# EAGLE design T00R10 (EAGLE 9.6.1)
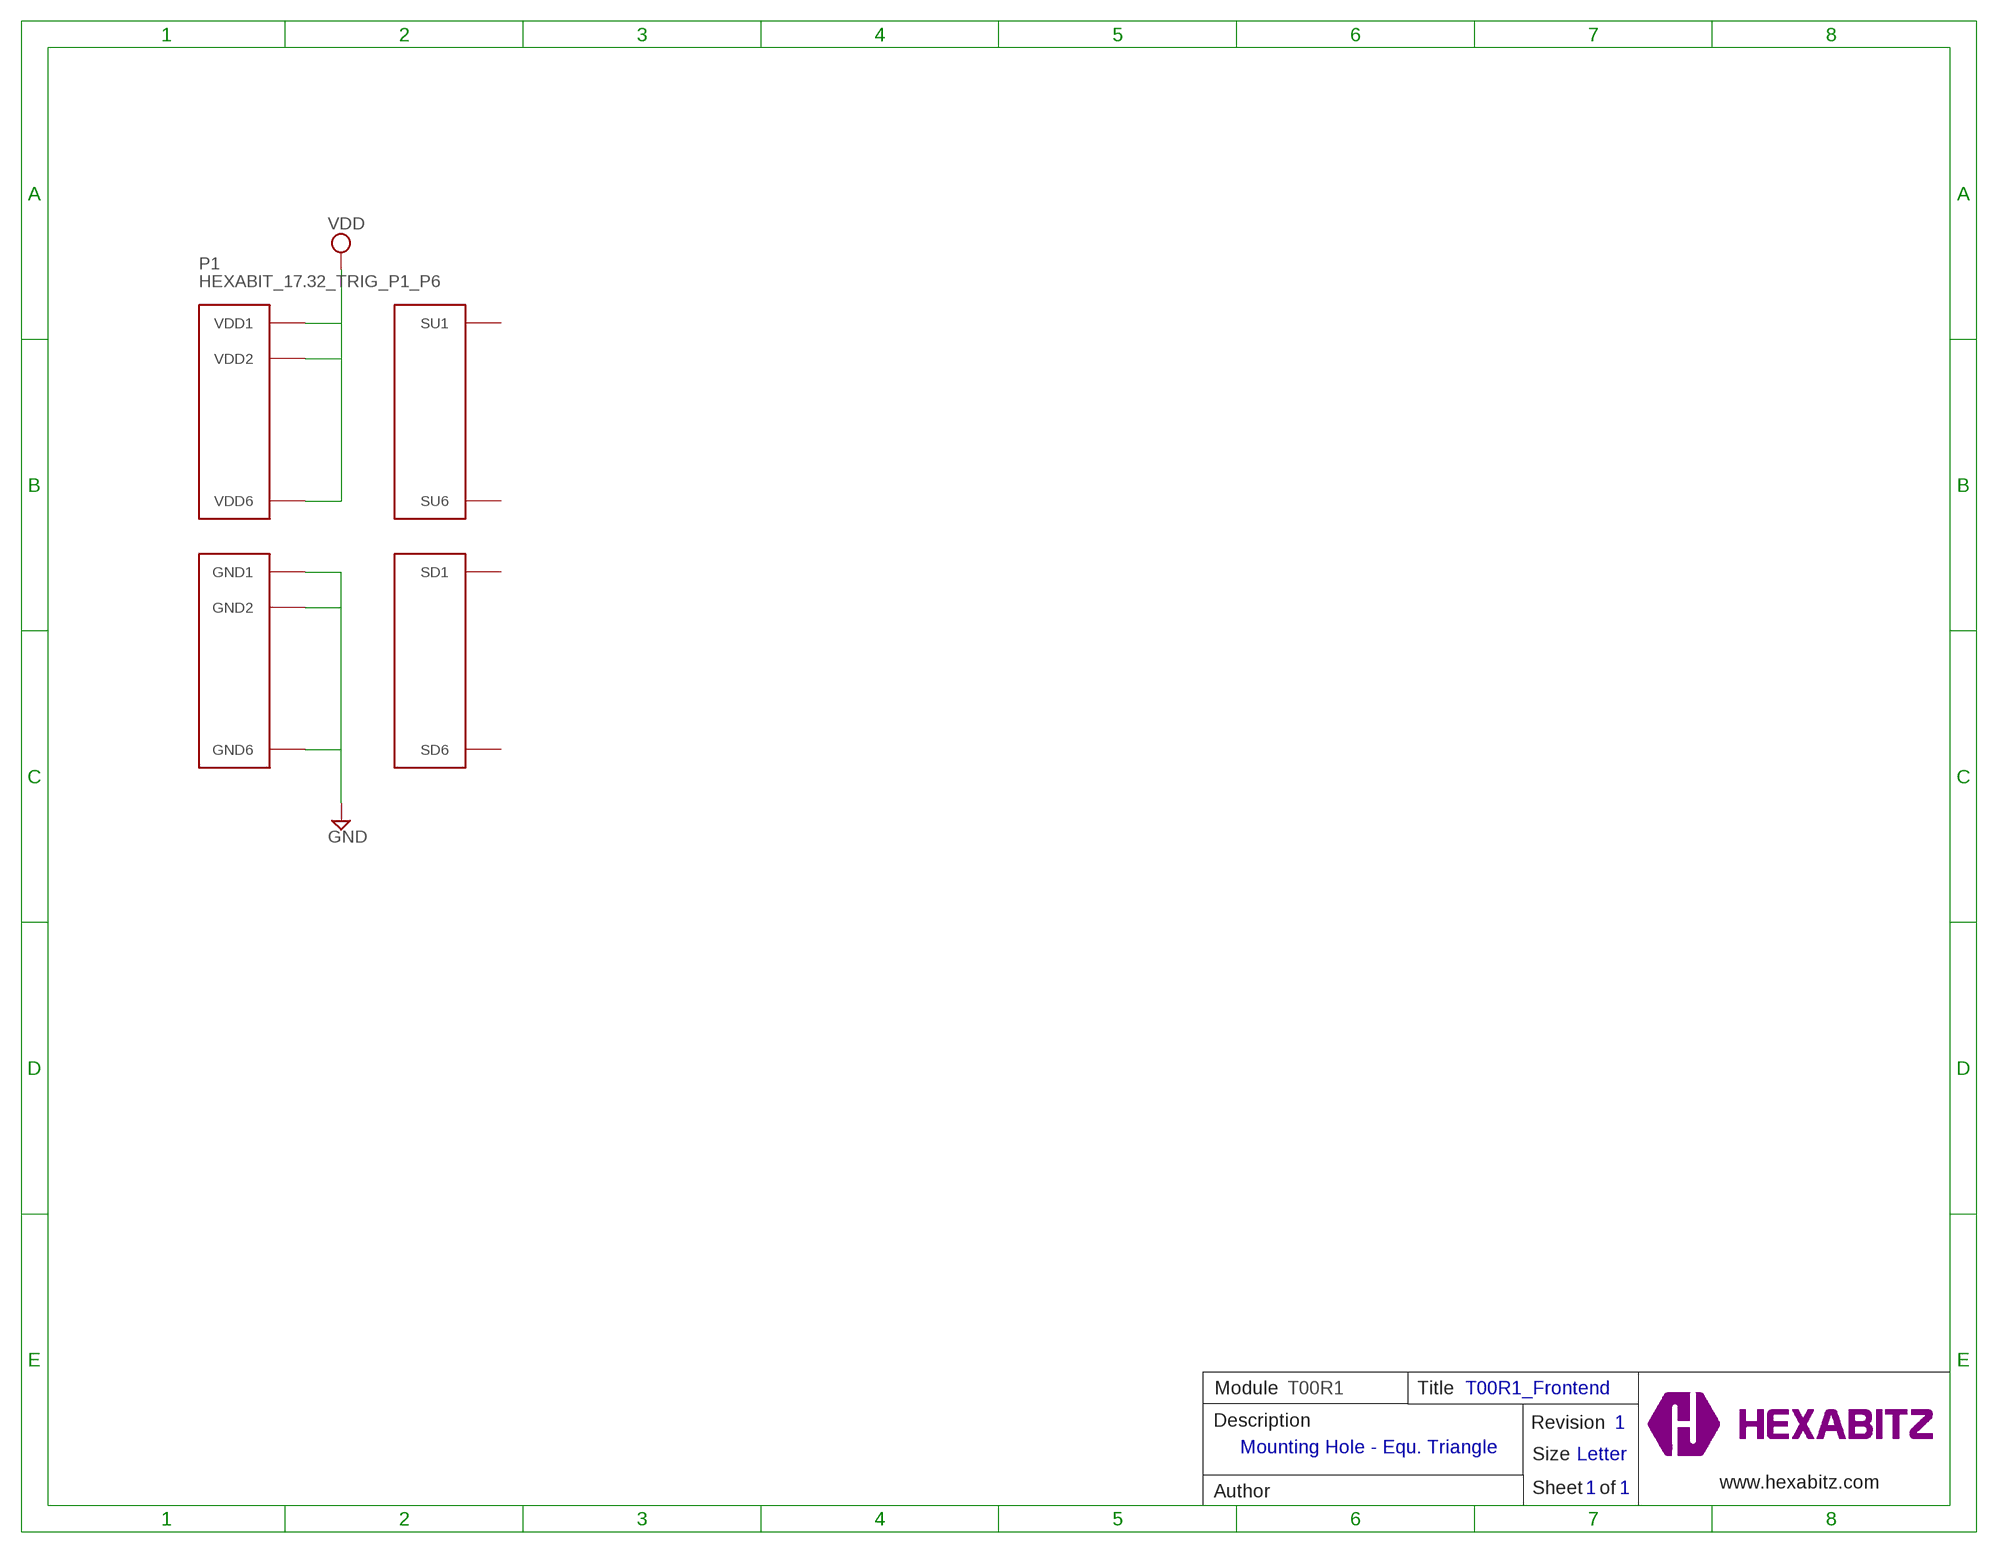
[diagram p0: schematic, sheet 1]

## Parts
P1  HEXABIT_17.32_TRIG_P1_P6  [HEXABIT_17.32_TRIG_P1_P6]

## Nets
GND: P1.PAD_PD7(GND1) P1.PAD_PD8(GND2) P1.PAD_PD12(GND6)
VDD: P1.PAD_PU7(VDD1) P1.PAD_PU8(VDD2) P1.PAD_PU12(VDD6)
Unconnected: P1.PAD_PD1(SD1) P1.PAD_PD6(SD6) P1.PAD_PU1(SU1) P1.PAD_PU6(SU6)

## Notes on the sheet
- Module | T00R1 | Title | T00R1_Frontend
- Description | Revision | 1
- Mounting Hole - Equ. Triangle
- Size | Letter
- www.hexabitz.com
- Author | Sheet   of | 1 | 1

## Library data of the parts
P1 = hexabitz_connectors:HEXABIT_17.32_TRIG_P1_P6: Hexabitz Hexagon Module Connector Hexagon side length = 17.32mm.

## Board
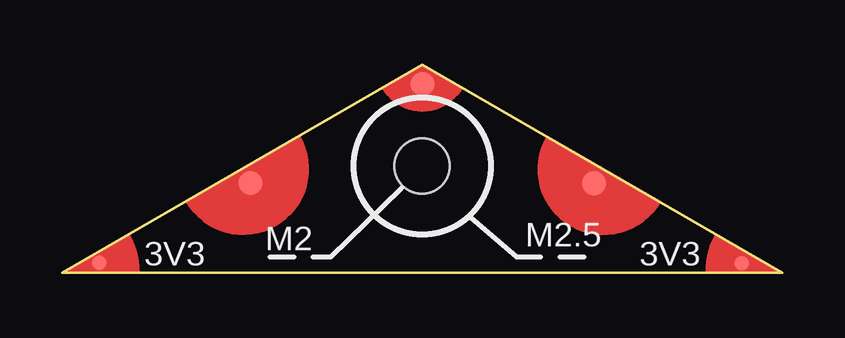
[diagram p1: board, top side]
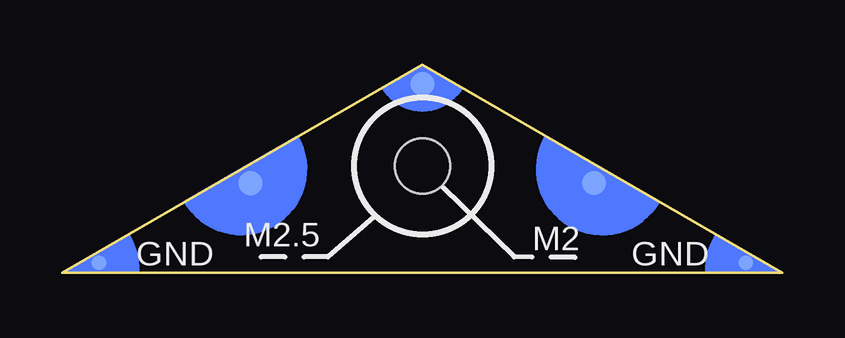
[diagram p2: board, bottom side, seen from below]

Size 30 x 8.66 mm. Coordinates in mm from the lower left corner, seen from the top.
Copper layers (1*16): Top 0.035mm / dielectric 1.5mm / Bottom 0.035mm
Design rules "2_layer *": minimum track width 7mil, minimum drill 10mil, track to track 6mil, track to pad 6mil, pad to pad 32mil, via to via 6mil, smd to smd 0mil, copper to edge 1mil, drill to drill 8mil, minimum pad ring 10mil, minimum via ring 8mil, stop-mask expansion 2mil, vias tented up to drill 15mil, thermal gap 10mil
Holes 2.3 mm at 14.99,4.45
tRestrict: area 12.1,1.6 to 17.8,7.3
bRestrict: area 12.1,1.6 to 17.8,7.3

### Footprints (pad centres in the part's own frame; a part is rotated, then mirrored left to right if it is on the bottom)
HEXABIT_17.32_TRIG_P1_P6 = smd 1 x 1 rotated 30 bottom: PAD_PD1 7.164,3.727; PAD_PD6 -7.146,3.733; PAD_PD7 0.008,7.863 | smd 0.61 x 0.61 rotated 30 bottom: PAD_PD8 13.484,0.417; PAD_PD12 -13.461,0.416 | smd 1 x 1 rotated 30: PAD_PU1 7.164,3.727; PAD_PU6 -7.146,3.733; PAD_PU7 0.008,7.863 | smd 0.61 x 0.61 rotated 30: PAD_PU8 13.316,0.401; PAD_PU12 -13.461,0.416

### Placement (x,y rotation side)
P1  14.99,0 0 top

### Tracks (layer width: path | path; a pad name or v marks a point on that pad's centre or on a via)
GND
  pour Bottom (no thermals): -0.04,0.01 29.95,0.01 14.96,8.7
VDD
  pour Top (no thermals): -0.04,0.01 29.95,0.01 14.97,8.69

### Text on the board
tPlace: M2.5 | 3V3 | M2 | 3V3
bPlace: M2.5 | GND | M2 | GND